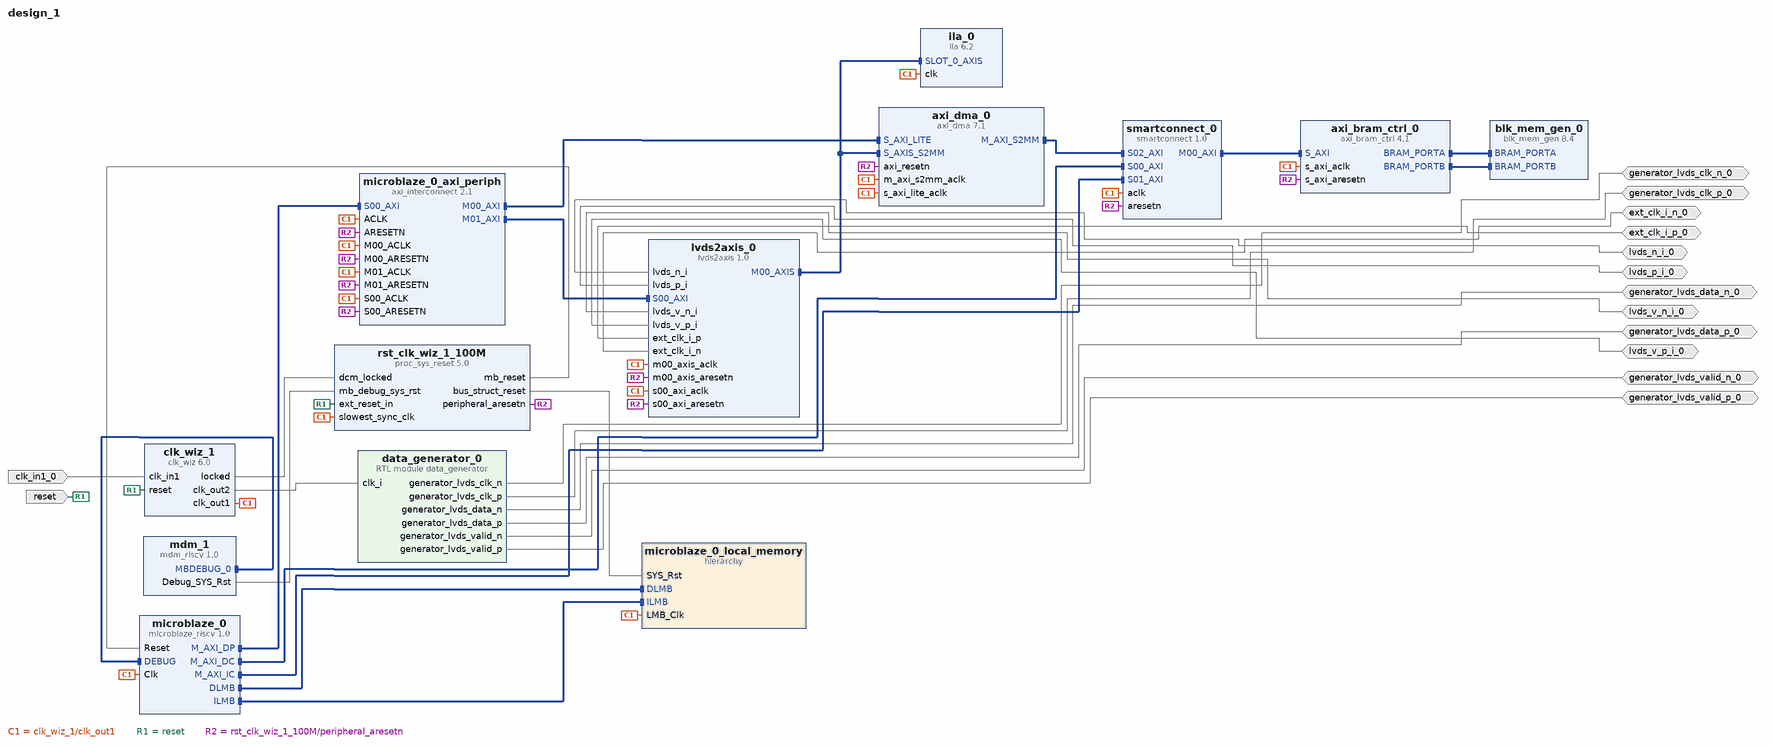
[diagram p0: block diagram of the top level]
# Vivado block design design_1, xc7a35tcpg236-1, Vivado 2024.1.2
create_bd_design design_1

create_bd_port -dir I -type rst reset
set_property -dict {CONFIG.POLARITY ACTIVE_HIGH} [get_bd_ports reset]
create_bd_port -dir I -type clk clk_in1_0
create_bd_port -dir IO -type clk generator_lvds_clk_n_0
create_bd_port -dir IO -type clk generator_lvds_clk_p_0
create_bd_port -dir IO generator_lvds_data_n_0
create_bd_port -dir IO generator_lvds_data_p_0
create_bd_port -dir IO generator_lvds_valid_n_0
create_bd_port -dir IO generator_lvds_valid_p_0
create_bd_port -dir IO lvds_n_i_0
create_bd_port -dir IO lvds_p_i_0
create_bd_port -dir IO lvds_v_n_i_0
create_bd_port -dir IO lvds_v_p_i_0
create_bd_port -dir IO ext_clk_i_p_0
create_bd_port -dir IO ext_clk_i_n_0

create_bd_cell -type ip -vlnv xilinx.com:ip:smartconnect:1.0 smartconnect_0
set_property -dict {CONFIG.NUM_SI 3} [get_bd_cells smartconnect_0]
create_bd_cell -type ip -vlnv xilinx.com:ip:axi_bram_ctrl:4.1 axi_bram_ctrl_0
create_bd_cell -type ip -vlnv xilinx.com:ip:blk_mem_gen:8.4 blk_mem_gen_0
set_property -dict {CONFIG.Memory_Type True_Dual_Port_RAM} [get_bd_cells blk_mem_gen_0]
create_bd_cell -type hier microblaze_0_local_memory
create_bd_cell -type ip -vlnv xilinx.com:ip:clk_wiz:6.0 clk_wiz_1
set_property -dict [list \
  CONFIG.CLKOUT1_JITTER 137.681 \
  CONFIG.CLKOUT1_PHASE_ERROR 105.461 \
  CONFIG.CLKOUT2_JITTER 170.699 \
  CONFIG.CLKOUT2_PHASE_ERROR 105.461 \
  CONFIG.CLKOUT2_REQUESTED_OUT_FREQ 36 \
  CONFIG.CLKOUT2_USED true \
  CONFIG.MMCM_CLKFBOUT_MULT_F 9.000 \
  CONFIG.MMCM_CLKOUT0_DIVIDE_F 9.000 \
  CONFIG.MMCM_CLKOUT1_DIVIDE 25 \
  CONFIG.NUM_OUT_CLKS 2 \
  CONFIG.PRIM_SOURCE Single_ended_clock_capable_pin \
  CONFIG.RESET_BOARD_INTERFACE reset \
  CONFIG.USE_BOARD_FLOW true \
] [get_bd_cells clk_wiz_1]
create_bd_cell -type ip -vlnv xilinx.com:ip:proc_sys_reset:5.0 rst_clk_wiz_1_100M
set_property -dict {CONFIG.RESET_BOARD_INTERFACE reset CONFIG.USE_BOARD_FLOW true} [get_bd_cells rst_clk_wiz_1_100M]
create_bd_cell -type ip -vlnv xilinx.com:ip:mdm_riscv:1.0 mdm_1
set_property -dict [list \
  CONFIG.C_ADDR_SIZE 32 \
  CONFIG.C_AVOID_PRIMITIVES 0 \
  CONFIG.C_BRK 0 \
  CONFIG.C_BSCANID 76547328 \
  CONFIG.C_DATA_SIZE 32 \
  CONFIG.C_DBG_MEM_ACCESS 0 \
  CONFIG.C_DBG_REG_ACCESS 0 \
  CONFIG.C_DEBUG_INTERFACE 0 \
  CONFIG.C_INTERCONNECT 2 \
  CONFIG.C_JTAG_CHAIN 2 \
  CONFIG.C_LMB_PROTOCOL 0 \
  CONFIG.C_MB_DBG_PORTS 1 \
  CONFIG.C_M_AXIS_DATA_WIDTH 32 \
  CONFIG.C_M_AXIS_ID_WIDTH 7 \
  CONFIG.C_M_AXI_ADDR_WIDTH 32 \
  CONFIG.C_M_AXI_DATA_WIDTH 32 \
  CONFIG.C_M_AXI_THREAD_ID_WIDTH 1 \
  CONFIG.C_S_AXI_ACLK_FREQ_HZ 100000000 \
  CONFIG.C_S_AXI_ADDR_WIDTH 9 \
  CONFIG.C_S_AXI_DATA_WIDTH 32 \
  CONFIG.C_USE_BSCAN 0 \
  CONFIG.C_USE_CONFIG_RESET 0 \
  CONFIG.C_XMTC 0 \
] [get_bd_cells mdm_1]
create_bd_cell -type ip -vlnv xilinx.com:ip:microblaze_riscv:1.0 microblaze_0
set_property -dict [list \
  CONFIG.C_ADDR_SIZE 32 \
  CONFIG.C_ASYNC_INTERRUPT 1 \
  CONFIG.C_ASYNC_WAKEUP 1 \
  CONFIG.C_AVOID_PRIMITIVES 0 \
  CONFIG.C_BASE_VECTORS 0x0000000000000000 \
  CONFIG.C_BRANCH_TARGET_CACHE_SIZE 0 \
  CONFIG.C_DATA_SIZE 32 \
  CONFIG.C_DCACHE_BASEADDR 0x0000000000000000 \
  CONFIG.C_DCACHE_BYTE_SIZE 65536 \
  CONFIG.C_DCACHE_HIGHADDR 0x000000003fffffff \
  CONFIG.C_DCACHE_LINE_LEN 4 \
  CONFIG.C_DCACHE_USE_WRITEBACK 0 \
  CONFIG.C_DC_AXI_MON 0 \
  CONFIG.C_DEBUG_COUNTER_WIDTH 32 \
  CONFIG.C_DEBUG_ENABLED 1 \
  CONFIG.C_DEBUG_EVENT_COUNTERS 5 \
  CONFIG.C_DEBUG_INTERFACE 0 \
  CONFIG.C_DEBUG_LATENCY_COUNTERS 1 \
  CONFIG.C_DEBUG_TRACE_ASYNC_RESET 0 \
  CONFIG.C_DP_AXI_MON 0 \
  CONFIG.C_D_AXI 1 \
  CONFIG.C_D_LMB 1 \
  CONFIG.C_D_LMB_MON 0 \
  CONFIG.C_D_LMB_PROTOCOL 0 \
  CONFIG.C_ECC_USE_CE_EXCEPTION 0 \
  CONFIG.C_EDGE_IS_POSITIVE 1 \
  CONFIG.C_ENABLE_DISCRETE_PORTS 0 \
  CONFIG.C_FAULT_TOLERANT 0 \
  CONFIG.C_FREQ 0 \
  CONFIG.C_FSL_LINKS 0 \
  CONFIG.C_ICACHE_BASEADDR 0x0000000000000000 \
  CONFIG.C_ICACHE_BYTE_SIZE 65536 \
  CONFIG.C_ICACHE_DATA_WIDTH 0 \
  CONFIG.C_ICACHE_HIGHADDR 0x000000003fffffff \
  CONFIG.C_ICACHE_LINE_LEN 4 \
  CONFIG.C_ICACHE_STREAMS 0 \
  CONFIG.C_ICACHE_VICTIMS 0 \
  CONFIG.C_IC_AXI_MON 0 \
  CONFIG.C_ILL_INSTR_EXCEPTION 0 \
  CONFIG.C_IMPRECISE_EXCEPTIONS 0 \
  CONFIG.C_INSTANCE microblaze \
  CONFIG.C_INTERCONNECT 2 \
  CONFIG.C_INTERRUPT_IS_EDGE 0 \
  CONFIG.C_INTERRUPT_MON 0 \
  CONFIG.C_IP_AXI_MON 0 \
  CONFIG.C_I_AXI 0 \
  CONFIG.C_I_LMB 1 \
  CONFIG.C_I_LMB_MON 0 \
  CONFIG.C_I_LMB_PROTOCOL 0 \
  CONFIG.C_LMB_DATA_SIZE 32 \
  CONFIG.C_LOCKSTEP_SELECT 0 \
  CONFIG.C_LOCKSTEP_SLAVE 0 \
  CONFIG.C_M0_AXIS_DATA_WIDTH 32 \
  CONFIG.C_M0_AXIS_PROTOCOL GENERIC \
  CONFIG.C_M10_AXIS_DATA_WIDTH 32 \
  CONFIG.C_M10_AXIS_PROTOCOL GENERIC \
  CONFIG.C_M11_AXIS_DATA_WIDTH 32 \
  CONFIG.C_M11_AXIS_PROTOCOL GENERIC \
  CONFIG.C_M12_AXIS_DATA_WIDTH 32 \
  CONFIG.C_M12_AXIS_PROTOCOL GENERIC \
  CONFIG.C_M13_AXIS_DATA_WIDTH 32 \
  CONFIG.C_M13_AXIS_PROTOCOL GENERIC \
  CONFIG.C_M14_AXIS_DATA_WIDTH 32 \
  CONFIG.C_M14_AXIS_PROTOCOL GENERIC \
  CONFIG.C_M15_AXIS_DATA_WIDTH 32 \
  CONFIG.C_M15_AXIS_PROTOCOL GENERIC \
  CONFIG.C_M1_AXIS_DATA_WIDTH 32 \
  CONFIG.C_M1_AXIS_PROTOCOL GENERIC \
  CONFIG.C_M2_AXIS_DATA_WIDTH 32 \
  CONFIG.C_M2_AXIS_PROTOCOL GENERIC \
  CONFIG.C_M3_AXIS_DATA_WIDTH 32 \
  CONFIG.C_M3_AXIS_PROTOCOL GENERIC \
  CONFIG.C_M4_AXIS_DATA_WIDTH 32 \
  CONFIG.C_M4_AXIS_PROTOCOL GENERIC \
  CONFIG.C_M5_AXIS_DATA_WIDTH 32 \
  CONFIG.C_M5_AXIS_PROTOCOL GENERIC \
  CONFIG.C_M6_AXIS_DATA_WIDTH 32 \
  CONFIG.C_M6_AXIS_PROTOCOL GENERIC \
  CONFIG.C_M7_AXIS_DATA_WIDTH 32 \
  CONFIG.C_M7_AXIS_PROTOCOL GENERIC \
  CONFIG.C_M8_AXIS_DATA_WIDTH 32 \
  CONFIG.C_M8_AXIS_PROTOCOL GENERIC \
  CONFIG.C_M9_AXIS_DATA_WIDTH 32 \
  CONFIG.C_M9_AXIS_PROTOCOL GENERIC \
  CONFIG.C_MISALIGNED_EXCEPTIONS 0 \
  CONFIG.C_MMU_PRIVILEGED_INSTR 0 \
  CONFIG.C_M_AXI_DC_ADDR_WIDTH 32 \
  CONFIG.C_M_AXI_DC_ARUSER_WIDTH 5 \
  CONFIG.C_M_AXI_DC_AWUSER_WIDTH 5 \
  CONFIG.C_M_AXI_DC_BUSER_WIDTH 1 \
  CONFIG.C_M_AXI_DC_EXCLUSIVE_ACCESS 0 \
  CONFIG.C_M_AXI_DC_RUSER_WIDTH 1 \
  CONFIG.C_M_AXI_DC_THREAD_ID_WIDTH 1 \
  CONFIG.C_M_AXI_DC_USER_SIGNALS 1 \
  CONFIG.C_M_AXI_DC_USER_VALUE 31 \
  CONFIG.C_M_AXI_DC_WUSER_WIDTH 1 \
  CONFIG.C_M_AXI_DP_ADDR_WIDTH 32 \
  CONFIG.C_M_AXI_DP_DATA_WIDTH 32 \
  CONFIG.C_M_AXI_DP_EXCLUSIVE_ACCESS 0 \
  CONFIG.C_M_AXI_DP_THREAD_ID_WIDTH 1 \
  CONFIG.C_M_AXI_D_BUS_EXCEPTION 0 \
  CONFIG.C_M_AXI_IC_ADDR_WIDTH 32 \
  CONFIG.C_M_AXI_IC_ARUSER_WIDTH 5 \
  CONFIG.C_M_AXI_IC_AWUSER_WIDTH 5 \
  CONFIG.C_M_AXI_IC_BUSER_WIDTH 1 \
  CONFIG.C_M_AXI_IC_RUSER_WIDTH 1 \
  CONFIG.C_M_AXI_IC_THREAD_ID_WIDTH 1 \
  CONFIG.C_M_AXI_IC_USER_SIGNALS 1 \
  CONFIG.C_M_AXI_IC_USER_VALUE 31 \
  CONFIG.C_M_AXI_IC_WUSER_WIDTH 1 \
  CONFIG.C_M_AXI_IP_ADDR_WIDTH 32 \
  CONFIG.C_M_AXI_IP_DATA_WIDTH 32 \
  CONFIG.C_M_AXI_IP_THREAD_ID_WIDTH 1 \
  CONFIG.C_M_AXI_I_BUS_EXCEPTION 0 \
  CONFIG.C_NUMBER_OF_PC_BRK 1 \
  CONFIG.C_NUMBER_OF_RD_ADDR_BRK 0 \
  CONFIG.C_NUMBER_OF_WR_ADDR_BRK 0 \
  CONFIG.C_NUM_SYNC_FF_CLK 2 \
  CONFIG.C_NUM_SYNC_FF_CLK_DEBUG 2 \
  CONFIG.C_NUM_SYNC_FF_CLK_IRQ 1 \
  CONFIG.C_NUM_SYNC_FF_DBG_CLK 1 \
  CONFIG.C_NUM_SYNC_FF_DBG_TRACE_CLK 2 \
  CONFIG.C_OPTIMIZATION 0 \
  CONFIG.C_PC_WIDTH 32 \
  CONFIG.C_S0_AXIS_DATA_WIDTH 32 \
  CONFIG.C_S0_AXIS_PROTOCOL GENERIC \
  CONFIG.C_S10_AXIS_DATA_WIDTH 32 \
  CONFIG.C_S10_AXIS_PROTOCOL GENERIC \
  CONFIG.C_S11_AXIS_DATA_WIDTH 32 \
  CONFIG.C_S11_AXIS_PROTOCOL GENERIC \
  CONFIG.C_S12_AXIS_DATA_WIDTH 32 \
  CONFIG.C_S12_AXIS_PROTOCOL GENERIC \
  CONFIG.C_S13_AXIS_DATA_WIDTH 32 \
  CONFIG.C_S13_AXIS_PROTOCOL GENERIC \
  CONFIG.C_S14_AXIS_DATA_WIDTH 32 \
  CONFIG.C_S14_AXIS_PROTOCOL GENERIC \
  CONFIG.C_S15_AXIS_DATA_WIDTH 32 \
  CONFIG.C_S15_AXIS_PROTOCOL GENERIC \
  CONFIG.C_S1_AXIS_DATA_WIDTH 32 \
  CONFIG.C_S1_AXIS_PROTOCOL GENERIC \
  CONFIG.C_S2_AXIS_DATA_WIDTH 32 \
  CONFIG.C_S2_AXIS_PROTOCOL GENERIC \
  CONFIG.C_S3_AXIS_DATA_WIDTH 32 \
  CONFIG.C_S3_AXIS_PROTOCOL GENERIC \
  CONFIG.C_S4_AXIS_DATA_WIDTH 32 \
  CONFIG.C_S4_AXIS_PROTOCOL GENERIC \
  CONFIG.C_S5_AXIS_DATA_WIDTH 32 \
  CONFIG.C_S5_AXIS_PROTOCOL GENERIC \
  CONFIG.C_S6_AXIS_DATA_WIDTH 32 \
  CONFIG.C_S6_AXIS_PROTOCOL GENERIC \
  CONFIG.C_S7_AXIS_DATA_WIDTH 32 \
  CONFIG.C_S7_AXIS_PROTOCOL GENERIC \
  CONFIG.C_S8_AXIS_DATA_WIDTH 32 \
  CONFIG.C_S8_AXIS_PROTOCOL GENERIC \
  CONFIG.C_S9_AXIS_DATA_WIDTH 32 \
  CONFIG.C_S9_AXIS_PROTOCOL GENERIC \
  CONFIG.C_TEMPORAL_DEPTH 0 \
  CONFIG.C_TRACE 0 \
  CONFIG.C_USE_ATOMIC 0 \
  CONFIG.C_USE_BARREL 2 \
  CONFIG.C_USE_BRANCH_TARGET_CACHE 0 \
  CONFIG.C_USE_COMPRESSION 1 \
  CONFIG.C_USE_CONFIG_RESET 0 \
  CONFIG.C_USE_DCACHE 1 \
  CONFIG.C_USE_EXT_BRK 1 \
  CONFIG.C_USE_EXT_NM_BRK 1 \
  CONFIG.C_USE_FPU 0 \
  CONFIG.C_USE_ICACHE 1 \
  CONFIG.C_USE_INTERRUPT 0 \
  CONFIG.C_USE_MMU 0 \
  CONFIG.C_USE_MULDIV 0 \
  CONFIG.C_USE_NON_SECURE 1 \
  CONFIG.G_TEMPLATE_LIST 0 \
] [get_bd_cells microblaze_0]
create_bd_cell -type ip -vlnv xilinx.com:ip:axi_dma:7.1 axi_dma_0
set_property -dict {CONFIG.c_include_mm2s 0 CONFIG.c_include_sg 0} [get_bd_cells axi_dma_0]
create_bd_cell -type ip -vlnv xilinx.com:ip:axi_interconnect:2.1 microblaze_0_axi_periph
set_property -dict {CONFIG.NUM_MI 2} [get_bd_cells microblaze_0_axi_periph]
create_bd_cell -type module -reference data_generator data_generator_0
create_bd_cell -type ip -vlnv xilinx.com:user:lvds2axis:1.0 lvds2axis_0
create_bd_cell -type ip -vlnv xilinx.com:ip:ila:6.2 ila_0
set_property -dict {CONFIG.C_DATA_DEPTH 4096 CONFIG.C_INPUT_PIPE_STAGES 1 CONFIG.C_SLOT_0_AXI_PROTOCOL AXI4S} [get_bd_cells ila_0]

# ---- hierarchy /microblaze_0_local_memory ----
current_bd_instance /microblaze_0_local_memory
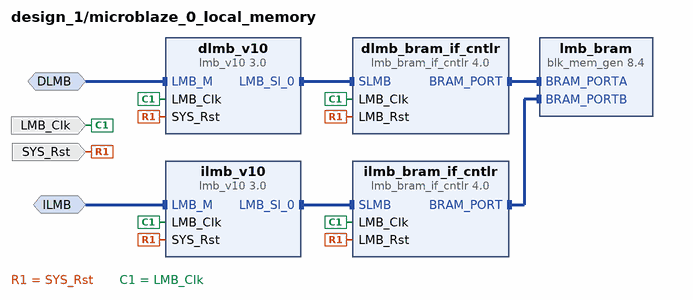
[diagram p1: block diagram inside /microblaze_0_local_memory]
create_bd_intf_pin -mode MirroredMaster -vlnv xilinx.com:interface:lmb_rtl:1.0 DLMB
create_bd_intf_pin -mode MirroredMaster -vlnv xilinx.com:interface:lmb_rtl:1.0 ILMB
create_bd_pin -dir I -type clk LMB_Clk
create_bd_pin -dir I -type rst SYS_Rst

create_bd_cell -type ip -vlnv xilinx.com:ip:lmb_v10:3.0 dlmb_v10
create_bd_cell -type ip -vlnv xilinx.com:ip:lmb_v10:3.0 ilmb_v10
create_bd_cell -type ip -vlnv xilinx.com:ip:lmb_bram_if_cntlr:4.0 dlmb_bram_if_cntlr
set_property -dict {CONFIG.C_ECC 1} [get_bd_cells dlmb_bram_if_cntlr]
create_bd_cell -type ip -vlnv xilinx.com:ip:lmb_bram_if_cntlr:4.0 ilmb_bram_if_cntlr
set_property -dict {CONFIG.C_ECC 1} [get_bd_cells ilmb_bram_if_cntlr]
create_bd_cell -type ip -vlnv xilinx.com:ip:blk_mem_gen:8.4 lmb_bram
set_property -dict {CONFIG.Memory_Type True_Dual_Port_RAM CONFIG.use_bram_block BRAM_Controller} [get_bd_cells lmb_bram]

# ---- connections ----

current_bd_instance /microblaze_0_local_memory
connect_bd_intf_net -intf_net microblaze_0_dlmb [get_bd_intf_pins dlmb_v10/LMB_M] [get_bd_intf_pins DLMB]
connect_bd_intf_net -intf_net microblaze_0_dlmb_bus [get_bd_intf_pins dlmb_v10/LMB_Sl_0] [get_bd_intf_pins dlmb_bram_if_cntlr/SLMB]
connect_bd_intf_net -intf_net microblaze_0_dlmb_cntlr [get_bd_intf_pins dlmb_bram_if_cntlr/BRAM_PORT] [get_bd_intf_pins lmb_bram/BRAM_PORTA]
connect_bd_intf_net -intf_net microblaze_0_ilmb [get_bd_intf_pins ilmb_v10/LMB_M] [get_bd_intf_pins ILMB]
connect_bd_intf_net -intf_net microblaze_0_ilmb_bus [get_bd_intf_pins ilmb_v10/LMB_Sl_0] [get_bd_intf_pins ilmb_bram_if_cntlr/SLMB]
connect_bd_intf_net -intf_net microblaze_0_ilmb_cntlr [get_bd_intf_pins ilmb_bram_if_cntlr/BRAM_PORT] [get_bd_intf_pins lmb_bram/BRAM_PORTB]
connect_bd_net [get_bd_pins SYS_Rst] \
  [get_bd_pins dlmb_v10/SYS_Rst] [get_bd_pins dlmb_bram_if_cntlr/LMB_Rst] [get_bd_pins ilmb_v10/SYS_Rst] \
  [get_bd_pins ilmb_bram_if_cntlr/LMB_Rst]
connect_bd_net -net microblaze_0_Clk [get_bd_pins LMB_Clk] \
  [get_bd_pins dlmb_v10/LMB_Clk] [get_bd_pins dlmb_bram_if_cntlr/LMB_Clk] [get_bd_pins ilmb_v10/LMB_Clk] \
  [get_bd_pins ilmb_bram_if_cntlr/LMB_Clk]
set_property HDL_ATTRIBUTE.BMM_INFO_ADDRESS_SPACE {byte  0x00000000 40 > design_1 microblaze_0_local_memory/lmb_bram} [get_bd_cells dlmb_bram_if_cntlr]
set_property HDL_ATTRIBUTE.KEEP_HIERARCHY yes [get_bd_cells dlmb_bram_if_cntlr]

current_bd_instance /
connect_bd_intf_net [get_bd_intf_pins blk_mem_gen_0/BRAM_PORTA] [get_bd_intf_pins axi_bram_ctrl_0/BRAM_PORTA]
connect_bd_intf_net [get_bd_intf_pins blk_mem_gen_0/BRAM_PORTB] [get_bd_intf_pins axi_bram_ctrl_0/BRAM_PORTB]
connect_bd_intf_net [get_bd_intf_pins axi_dma_0/M_AXI_S2MM] [get_bd_intf_pins smartconnect_0/S02_AXI]
connect_bd_intf_net [get_bd_intf_pins lvds2axis_0/M00_AXIS] [get_bd_intf_pins axi_dma_0/S_AXIS_S2MM]
connect_bd_intf_net [get_bd_intf_pins lvds2axis_0/M00_AXIS] [get_bd_intf_pins ila_0/SLOT_0_AXIS]
connect_bd_intf_net [get_bd_intf_pins microblaze_0/M_AXI_DC] [get_bd_intf_pins smartconnect_0/S00_AXI]
connect_bd_intf_net [get_bd_intf_pins microblaze_0/M_AXI_DP] [get_bd_intf_pins microblaze_0_axi_periph/S00_AXI]
connect_bd_intf_net [get_bd_intf_pins microblaze_0/M_AXI_IC] [get_bd_intf_pins smartconnect_0/S01_AXI]
connect_bd_intf_net [get_bd_intf_pins microblaze_0_axi_periph/M00_AXI] [get_bd_intf_pins axi_dma_0/S_AXI_LITE]
connect_bd_intf_net [get_bd_intf_pins microblaze_0_axi_periph/M01_AXI] [get_bd_intf_pins lvds2axis_0/S00_AXI]
connect_bd_intf_net [get_bd_intf_pins mdm_1/MBDEBUG_0] [get_bd_intf_pins microblaze_0/DEBUG]
connect_bd_intf_net [get_bd_intf_pins microblaze_0/DLMB] [get_bd_intf_pins microblaze_0_local_memory/DLMB]
connect_bd_intf_net [get_bd_intf_pins microblaze_0/ILMB] [get_bd_intf_pins microblaze_0_local_memory/ILMB]
connect_bd_intf_net [get_bd_intf_pins smartconnect_0/M00_AXI] [get_bd_intf_pins axi_bram_ctrl_0/S_AXI]
connect_bd_net [get_bd_ports generator_lvds_clk_n_0] [get_bd_pins data_generator_0/generator_lvds_clk_n]
connect_bd_net [get_bd_ports generator_lvds_clk_p_0] [get_bd_pins data_generator_0/generator_lvds_clk_p]
connect_bd_net [get_bd_ports generator_lvds_data_n_0] [get_bd_pins data_generator_0/generator_lvds_data_n]
connect_bd_net [get_bd_ports generator_lvds_data_p_0] [get_bd_pins data_generator_0/generator_lvds_data_p]
connect_bd_net [get_bd_ports generator_lvds_valid_n_0] [get_bd_pins data_generator_0/generator_lvds_valid_n]
connect_bd_net [get_bd_ports generator_lvds_valid_p_0] [get_bd_pins data_generator_0/generator_lvds_valid_p]
connect_bd_net [get_bd_ports lvds_n_i_0] [get_bd_pins lvds2axis_0/lvds_n_i]
connect_bd_net [get_bd_ports lvds_p_i_0] [get_bd_pins lvds2axis_0/lvds_p_i]
connect_bd_net [get_bd_ports lvds_v_n_i_0] [get_bd_pins lvds2axis_0/lvds_v_n_i]
connect_bd_net [get_bd_ports lvds_v_p_i_0] [get_bd_pins lvds2axis_0/lvds_v_p_i]
connect_bd_net [get_bd_ports ext_clk_i_p_0] [get_bd_pins lvds2axis_0/ext_clk_i_p]
connect_bd_net [get_bd_ports ext_clk_i_n_0] [get_bd_pins lvds2axis_0/ext_clk_i_n]
connect_bd_net -net clk_in1_0_1 [get_bd_ports clk_in1_0] [get_bd_pins clk_wiz_1/clk_in1]
connect_bd_net [get_bd_pins clk_wiz_1/clk_out2] [get_bd_pins data_generator_0/clk_i]
connect_bd_net [get_bd_pins clk_wiz_1/locked] [get_bd_pins rst_clk_wiz_1_100M/dcm_locked]
connect_bd_net [get_bd_pins mdm_1/Debug_SYS_Rst] [get_bd_pins rst_clk_wiz_1_100M/mb_debug_sys_rst]
connect_bd_net -net microblaze_0_Clk [get_bd_pins clk_wiz_1/clk_out1] \
  [get_bd_pins microblaze_0_local_memory/LMB_Clk] [get_bd_pins rst_clk_wiz_1_100M/slowest_sync_clk] \
  [get_bd_pins microblaze_0/Clk] [get_bd_pins axi_bram_ctrl_0/s_axi_aclk] [get_bd_pins smartconnect_0/aclk] \
  [get_bd_pins axi_dma_0/m_axi_s2mm_aclk] [get_bd_pins microblaze_0_axi_periph/S00_ACLK] \
  [get_bd_pins axi_dma_0/s_axi_lite_aclk] [get_bd_pins microblaze_0_axi_periph/M00_ACLK] \
  [get_bd_pins microblaze_0_axi_periph/ACLK] [get_bd_pins microblaze_0_axi_periph/M01_ACLK] \
  [get_bd_pins lvds2axis_0/s00_axi_aclk] [get_bd_pins lvds2axis_0/m00_axis_aclk] [get_bd_pins ila_0/clk]
connect_bd_net [get_bd_ports reset] [get_bd_pins clk_wiz_1/reset] [get_bd_pins rst_clk_wiz_1_100M/ext_reset_in]
connect_bd_net [get_bd_pins rst_clk_wiz_1_100M/bus_struct_reset] [get_bd_pins microblaze_0_local_memory/SYS_Rst]
connect_bd_net [get_bd_pins rst_clk_wiz_1_100M/mb_reset] [get_bd_pins microblaze_0/Reset]
connect_bd_net [get_bd_pins rst_clk_wiz_1_100M/peripheral_aresetn] \
  [get_bd_pins axi_bram_ctrl_0/s_axi_aresetn] [get_bd_pins smartconnect_0/aresetn] \
  [get_bd_pins microblaze_0_axi_periph/S00_ARESETN] [get_bd_pins axi_dma_0/axi_resetn] \
  [get_bd_pins microblaze_0_axi_periph/M00_ARESETN] [get_bd_pins microblaze_0_axi_periph/ARESETN] \
  [get_bd_pins microblaze_0_axi_periph/M01_ARESETN] [get_bd_pins lvds2axis_0/s00_axi_aresetn] \
  [get_bd_pins lvds2axis_0/m00_axis_aresetn]
set_property HDL_ATTRIBUTE.BMM_INFO_ADDRESS_SPACE {byte  0xC0000000 32 > design_1 blk_mem_gen_0} [get_bd_cells axi_bram_ctrl_0]
set_property HDL_ATTRIBUTE.KEEP_HIERARCHY yes [get_bd_cells axi_bram_ctrl_0]
set_property HDL_ATTRIBUTE.BMM_INFO_PROCESSOR {riscv > design_1 microblaze_0_local_memory/dlmb_bram_if_cntlr design_1 axi_bram_ctrl_0} [get_bd_cells microblaze_0]
set_property HDL_ATTRIBUTE.KEEP_HIERARCHY yes [get_bd_cells microblaze_0]

# ---- address map ----
assign_bd_address -offset 0xC0000000 -range 8K -target_address_space [get_bd_addr_spaces axi_dma_0/Data_S2MM] [get_bd_addr_segs axi_bram_ctrl_0/S_AXI/Mem0]
assign_bd_address -offset 0x00000000 -range 64K -target_address_space [get_bd_addr_spaces microblaze_0/Data] [get_bd_addr_segs microblaze_0_local_memory/dlmb_bram_if_cntlr/SLMB/Mem]
assign_bd_address -offset 0x41E00000 -range 64K -target_address_space [get_bd_addr_spaces microblaze_0/Data] [get_bd_addr_segs axi_dma_0/S_AXI_LITE/Reg]
assign_bd_address -offset 0x44A00000 -range 64K -target_address_space [get_bd_addr_spaces microblaze_0/Data] [get_bd_addr_segs lvds2axis_0/S00_AXI/S00_AXI_reg]
assign_bd_address -offset 0xC0000000 -range 8K -target_address_space [get_bd_addr_spaces microblaze_0/Data] [get_bd_addr_segs axi_bram_ctrl_0/S_AXI/Mem0]
assign_bd_address -offset 0x00000000 -range 64K -target_address_space [get_bd_addr_spaces microblaze_0/Instruction] [get_bd_addr_segs microblaze_0_local_memory/ilmb_bram_if_cntlr/SLMB/Mem]
assign_bd_address -offset 0xC0000000 -range 8K -target_address_space [get_bd_addr_spaces microblaze_0/Instruction] [get_bd_addr_segs axi_bram_ctrl_0/S_AXI/Mem0]

validate_bd_design
save_bd_design
